# EAGLE schematic schematic (EAGLE 9.6.2)
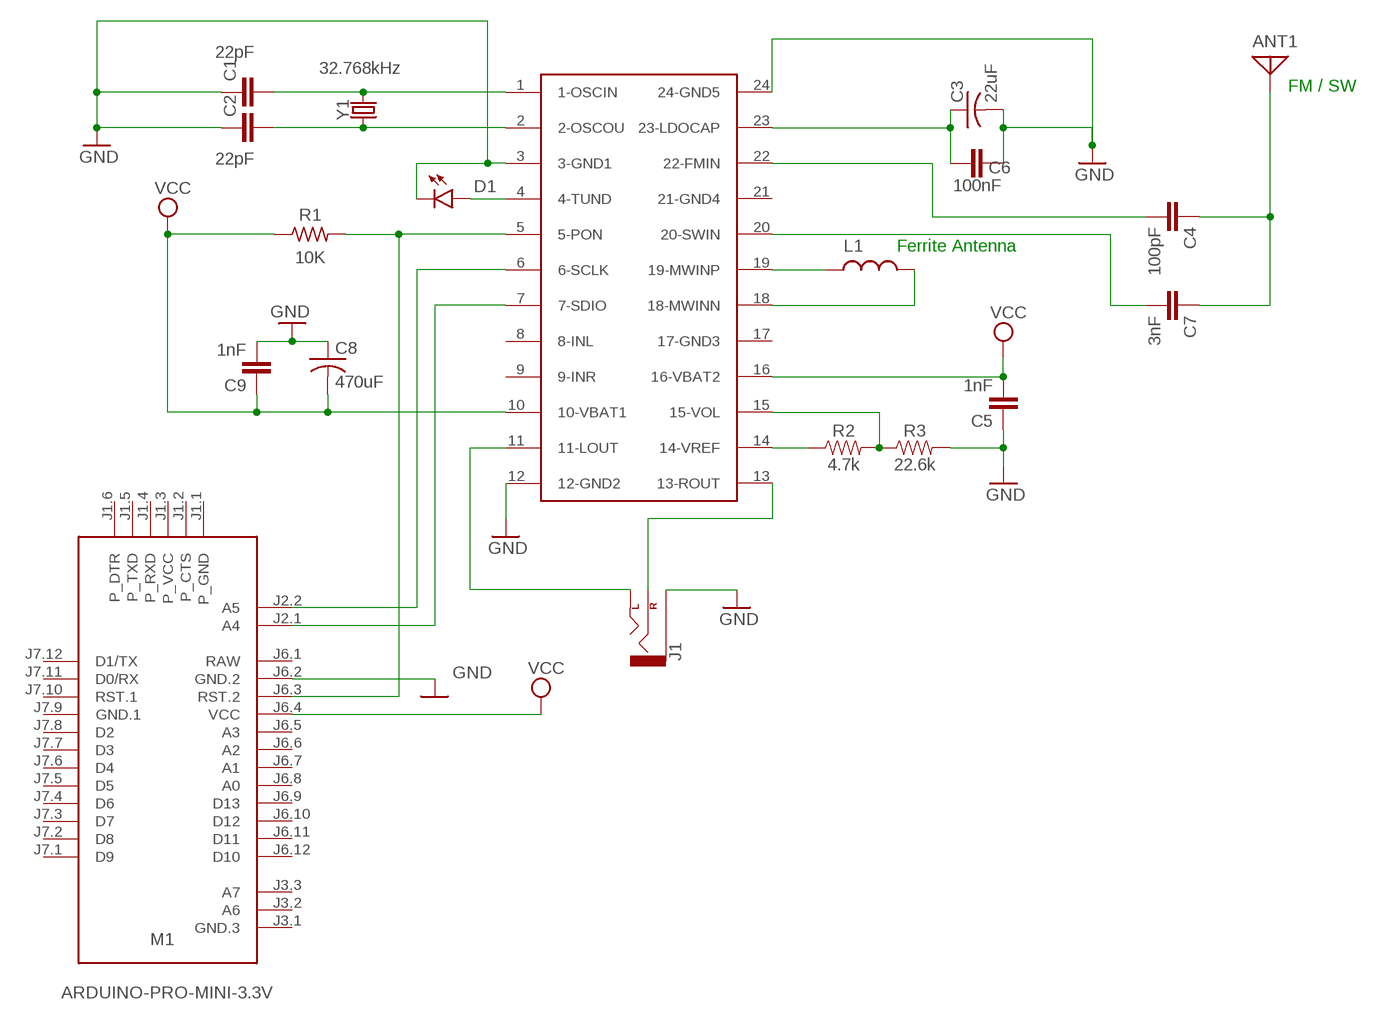
[diagram p0: schematic, sheet 1]

## Parts
ANT1  ANTENNA  [PAD-01]
C1  22pF  22PF-PTH-2.54MM-200V-5%  [CAP-PTH-2.54]
C2  22pF  22PF-PTH-2.54MM-200V-5%  [CAP-PTH-2.54]
C3  22uF  C-US025-024X044  [C025-024X044]
C4  100pF  C2,5-3  [C2.5-3]
C5  1nF  C2,5-3  [C2.5-3]
C6  100nF  C2,5-3  [C2.5-3]
C7  3nF  C2,5-3  [C2.5-3]
C8  470uF  C-US025-024X044  [C025-024X044]
C9  1nF  C2,5-3  [C2.5-3]
D1  LED5MM  [LED_5MM]
J1  AUDIO_JACK_2.5MMSPECIAL_POGO_PINS  [STEREOJACK2.5MM_SPECIAL_POGOPINS]
L1  L  (no package)
M1  ARDUINO-PRO-MINI-3.3V  [ARDUINO-PRO-MINI]
R1  10K  R-US_AXIAL-7.2MM-PITCH  [RESAD724W46L381D178B]
R2  4.7k  4.7KOHM-0603-1/10W-1%  [0603]
R3  22.6k  22.6KOHM-0603-1/10W-1%  [0603]
U$1  AKC6955AKC6955  [SOIC127P1032X265-24N]
Y1  32.768kHz  CRYSTAL-32.768kHzPTH-2X6  [CRYSTAL-PTH-2X6-CYL]

## Nets
GND: C1.1 C2.1 C3.2 C5.1 C6.1 C8.1 C9.2 D1.K(C) J1.RING1(SLEEVE) M1.J6.2(GND.2) R3.2 U$1.3(3-GND1) U$1.12(12-GND2) U$1.24(24-GND5)
N$1: M1.J6.3(RST.2) R1.2 U$1.5(5-PON)
N$2: M1.J2.2(A5) U$1.6(6-SCLK)
N$3: M1.J2.1(A4) U$1.7(7-SDIO)
N$4: C1.2 U$1.1(1-OSCIN) Y1.2
N$5: C2.2 U$1.2(2-OSCOU) Y1.1
N$6: D1.A U$1.4(4-TUND)
N$7: J1.SHIELD(LEFT) U$1.11(11-LOUT)
N$8: R2.1 U$1.14(14-VREF)
N$9: J1.TIP(RIGHT) U$1.13(13-ROUT)
N$10: R2.2 R3.1 U$1.15(15-VOL)
N$11: C3.1 C6.2 U$1.23(23-LDOCAP)
N$12: C4.2 U$1.22(22-FMIN)
N$13: ANT1.1 C4.1 C7.1
N$14: C7.2 U$1.20(20-SWIN)
N$16: L1.2 U$1.18(18-MWINN)
N$17: L1.1 U$1.19(19-MWINP)
VCC: C5.2 C8.2 C9.1 M1.J6.4(VCC) R1.1 U$1.10(10-VBAT1) U$1.16(16-VBAT2)
Unconnected: M1.J1.1(P_GND) M1.J1.2(P_CTS) M1.J1.3(P_VCC) M1.J1.4(P_RXD) M1.J1.5(P_TXD) M1.J1.6(P_DTR) M1.J3.1(GND.3) M1.J3.2(A6) M1.J3.3(A7) M1.J6.5(A3) M1.J6.6(A2) M1.J6.7(A1) M1.J6.8(A0) M1.J6.9(D13) M1.J6.10(D12) M1.J6.11(D11) M1.J6.12(D10) M1.J7.1(D9) M1.J7.2(D8) M1.J7.3(D7) M1.J7.4(D6) M1.J7.5(D5) M1.J7.6(D4) M1.J7.7(D3) M1.J7.8(D2) M1.J7.10(RST.1) M1.J7.11(D0/RX) M1.J7.12(D1/TX) U$1.8(8-INL) U$1.9(9-INR) U$1.17(17-GND3) U$1.21(21-GND4)

## Notes on the sheet
- FM / SW
- Ferrite Antenna

## Power pins joined to a net without a drawn wire
GND.1: M1.J7.9(GND.1)
RAW: M1.J6.1(RAW)

## Library data of the parts
ANT1 = discrete:ANTENNA: Antenna
C1 C2 = SparkFun-Capacitors:22PF: 22pF ceramic capacitors A capacitor is a passive two-terminal electrical component used to store electrical energy temporarily in an electric field.; PROD_ID: CAP-09128
C3 C8 = adafruit:C-US: CAPACITOR, American symbol
C4-C7 C9 = capacitor-wima:C: CAPACITOR naming: grid - package width
D1 = SparkFun-LED:LED: LED (Generic) Standard schematic elements and footprints for 5mm, 3mm, 1206, and 0603 sized LEDs. Generic LEDs with no color specified.
J1 = SparkFun-Connectors:AUDIO_JACK_2.5MM: Audio Jack 2.5mm variants of PTH and SMT audio jacks. SparkFun Products: SparkFun PicoBoard <https://www.sparkfun.com/products/11888>- 2.5mm SMD
L1 = ngspice-simulation:L: INDUCTOR
M1 = diy-modules:ARDUINO-PRO-MINI-*: Arduino Pro Mini and compatible devices More details available here: https://www.arduino.cc/en/Main/ArduinoBoardProMini Click here to find device on ebay.com <http://www.ebay.com/sch/arduino+pro+mini>
R1 = Resistor:R-US: Resistor Fixed - ANSI; CATEGORY: Resistor; SUB-CATEGORY: Fixed
R2 = SparkFun-Resistors:4.7KOHM: 4.7kΩ resistor A resistor is a passive two-terminal electrical component that implements electrical resistance as a circuit element. Resistors act to reduce current flow, and, at the same time, act to lower voltage levels within circuits. - Wikipedia; PROD_ID: RES-07857
R3 = SparkFun-Resistors:22.6KOHM: 22.6kΩ resistor A resistor is a passive two-terminal electrical component that implements electrical resistance as a circuit element. Resistors act to reduce current flow, and, at the same time, act to lower voltage levels within circuits. - Wikipedia; PROD_ID: RES-09384
U$1 = AKC:AKC6955
Y1 = SparkFun-Clocks:CRYSTAL-32.768kHz: 32.768kHz Crystal Frequency: 32.768kHz Frequency Stability: ±20ppm Load Capacitance: 12.5pF (PTH-2X6 & SMD-3.2X1.5), 6pF (SMD-2X6) SparkFun Products: SparkFun BigTime Watch Kit <https://www.sparkfun.com/products/11734> SparkFun nRF52832 Breakout <https://www.sparkfun.com/products/13990> SparkFun Real Time Clock Module <https://www.sparkfun.com/products/12708>; PROD_ID: XTAL-10112